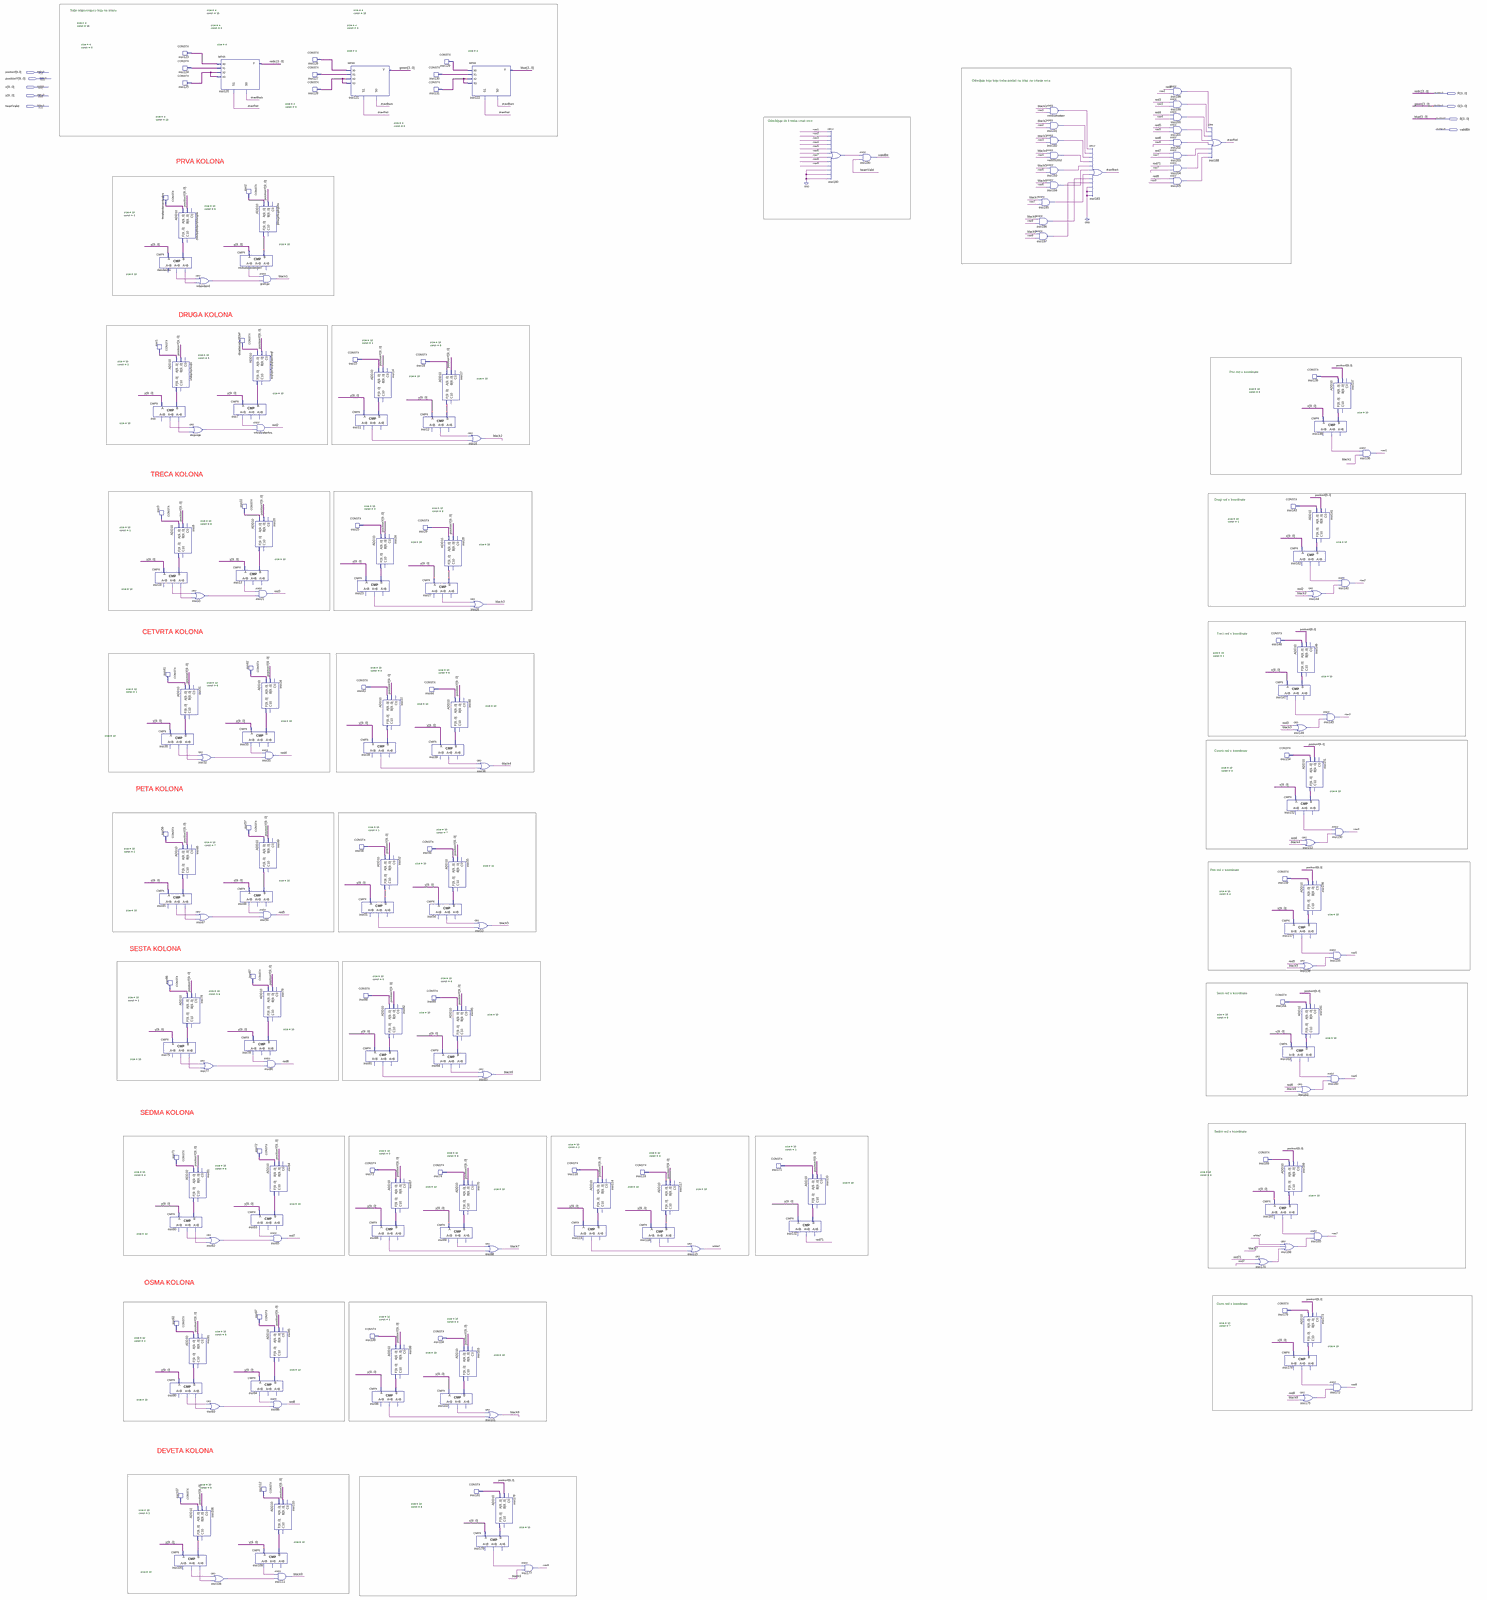
[diagram p0: schematic sheet, whole]
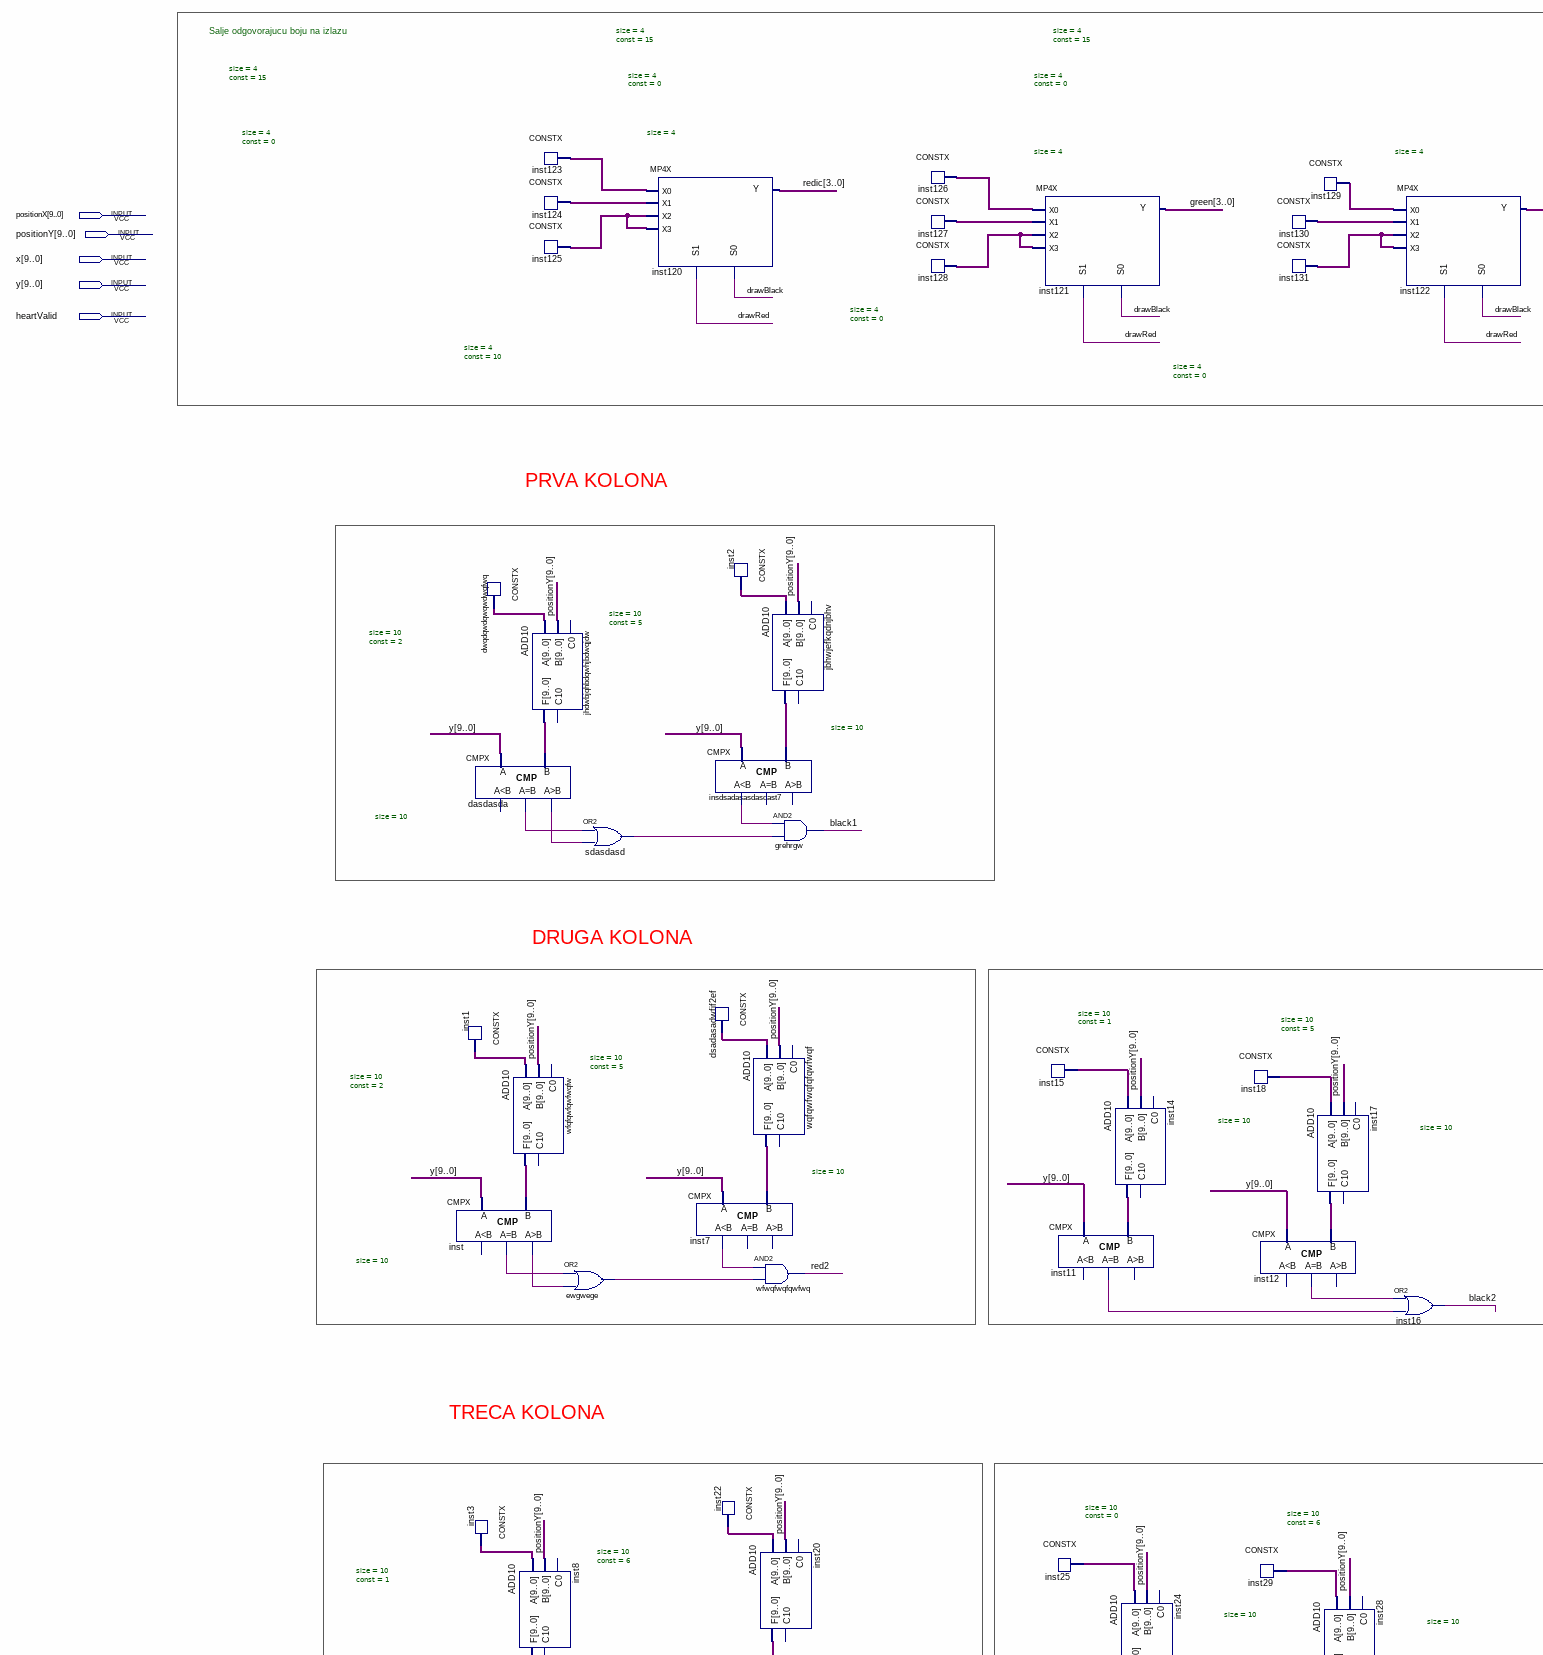
[diagram p1: schematic sheet, upper left part]
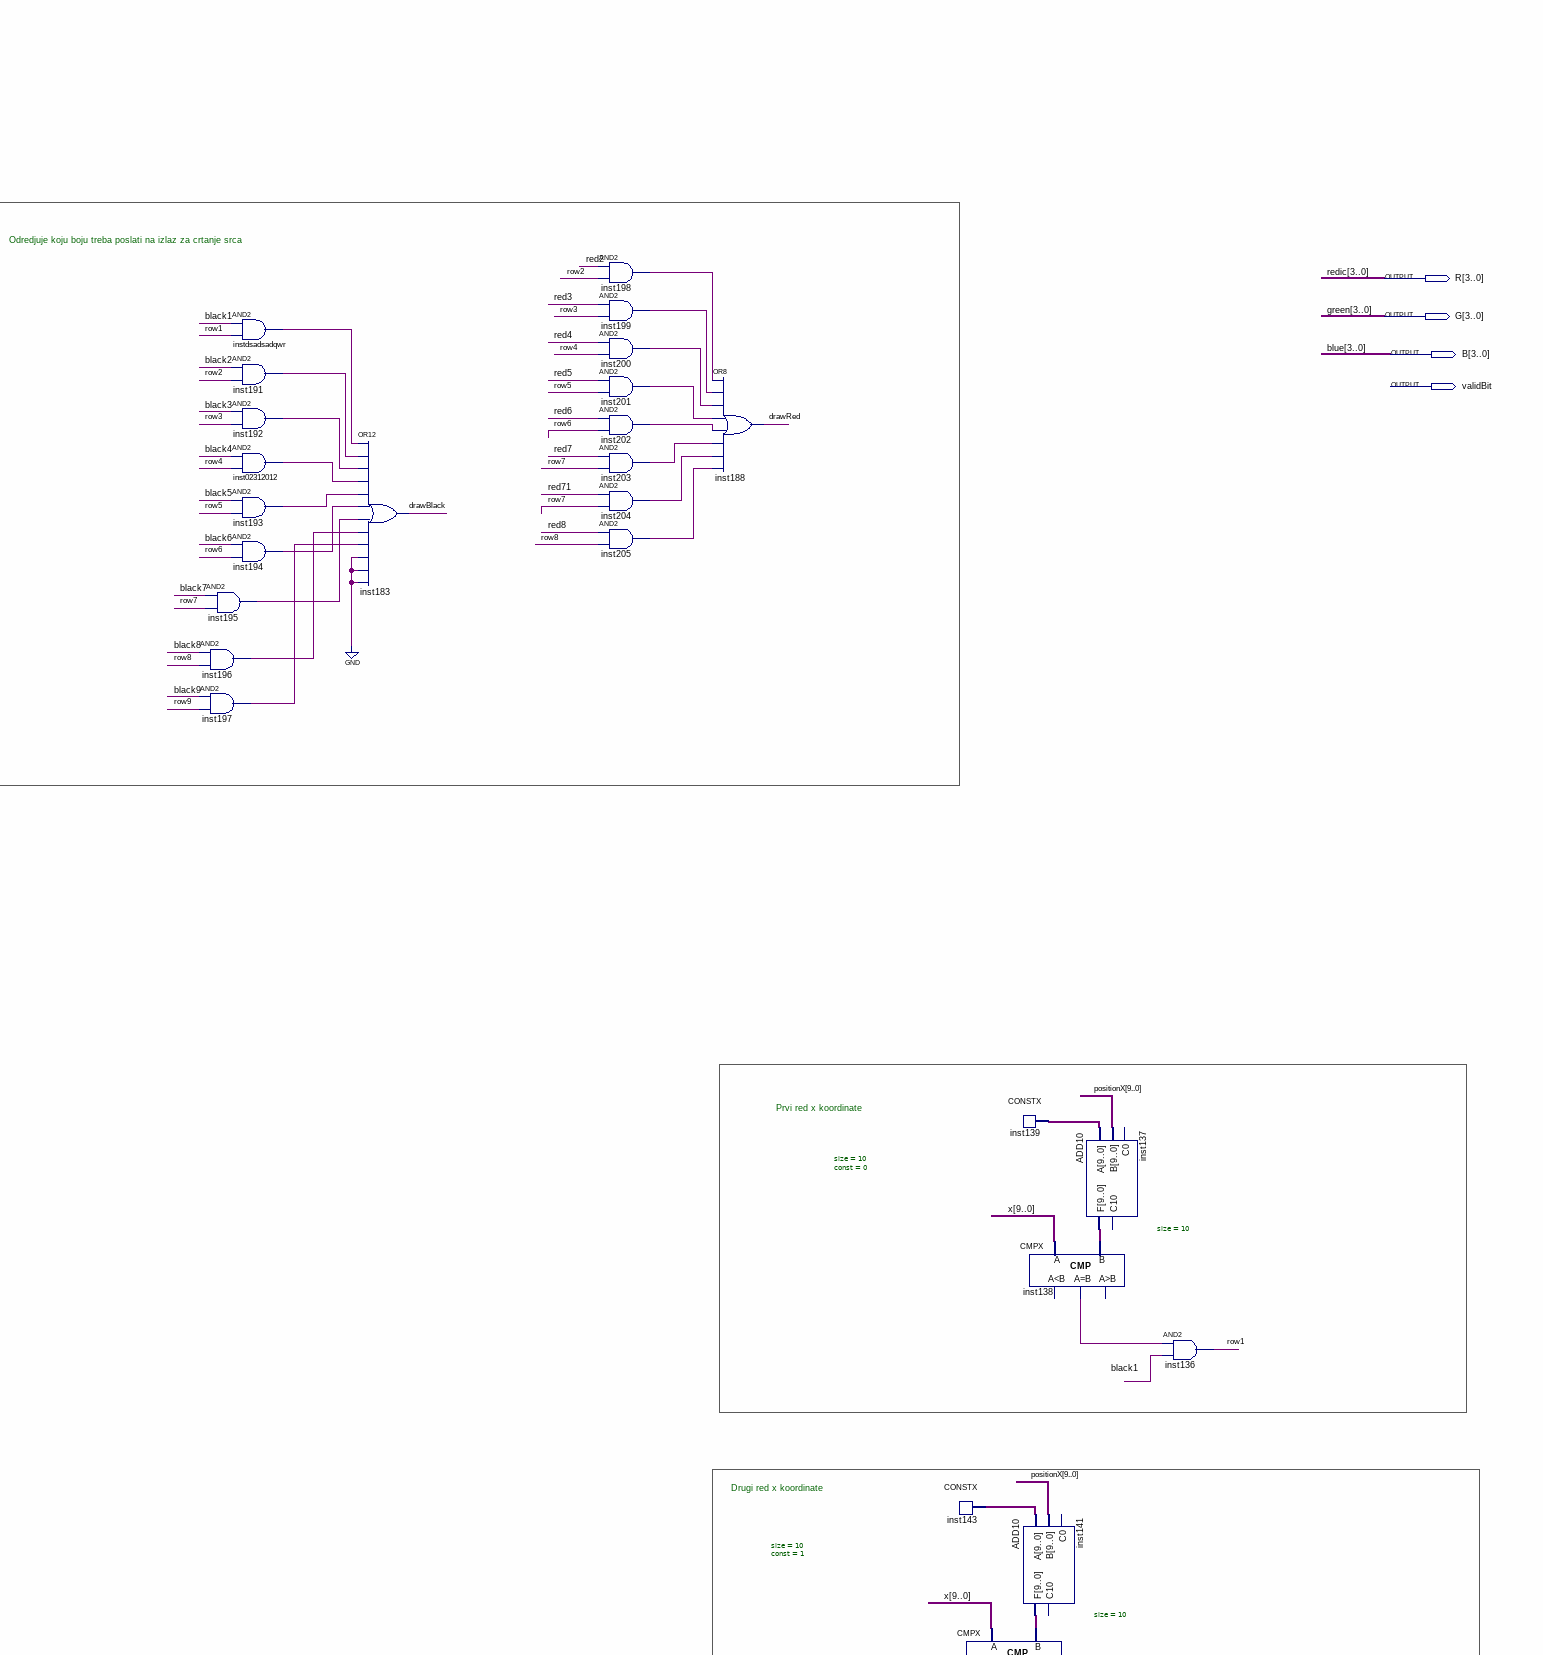
[diagram p2: schematic sheet, upper right part]
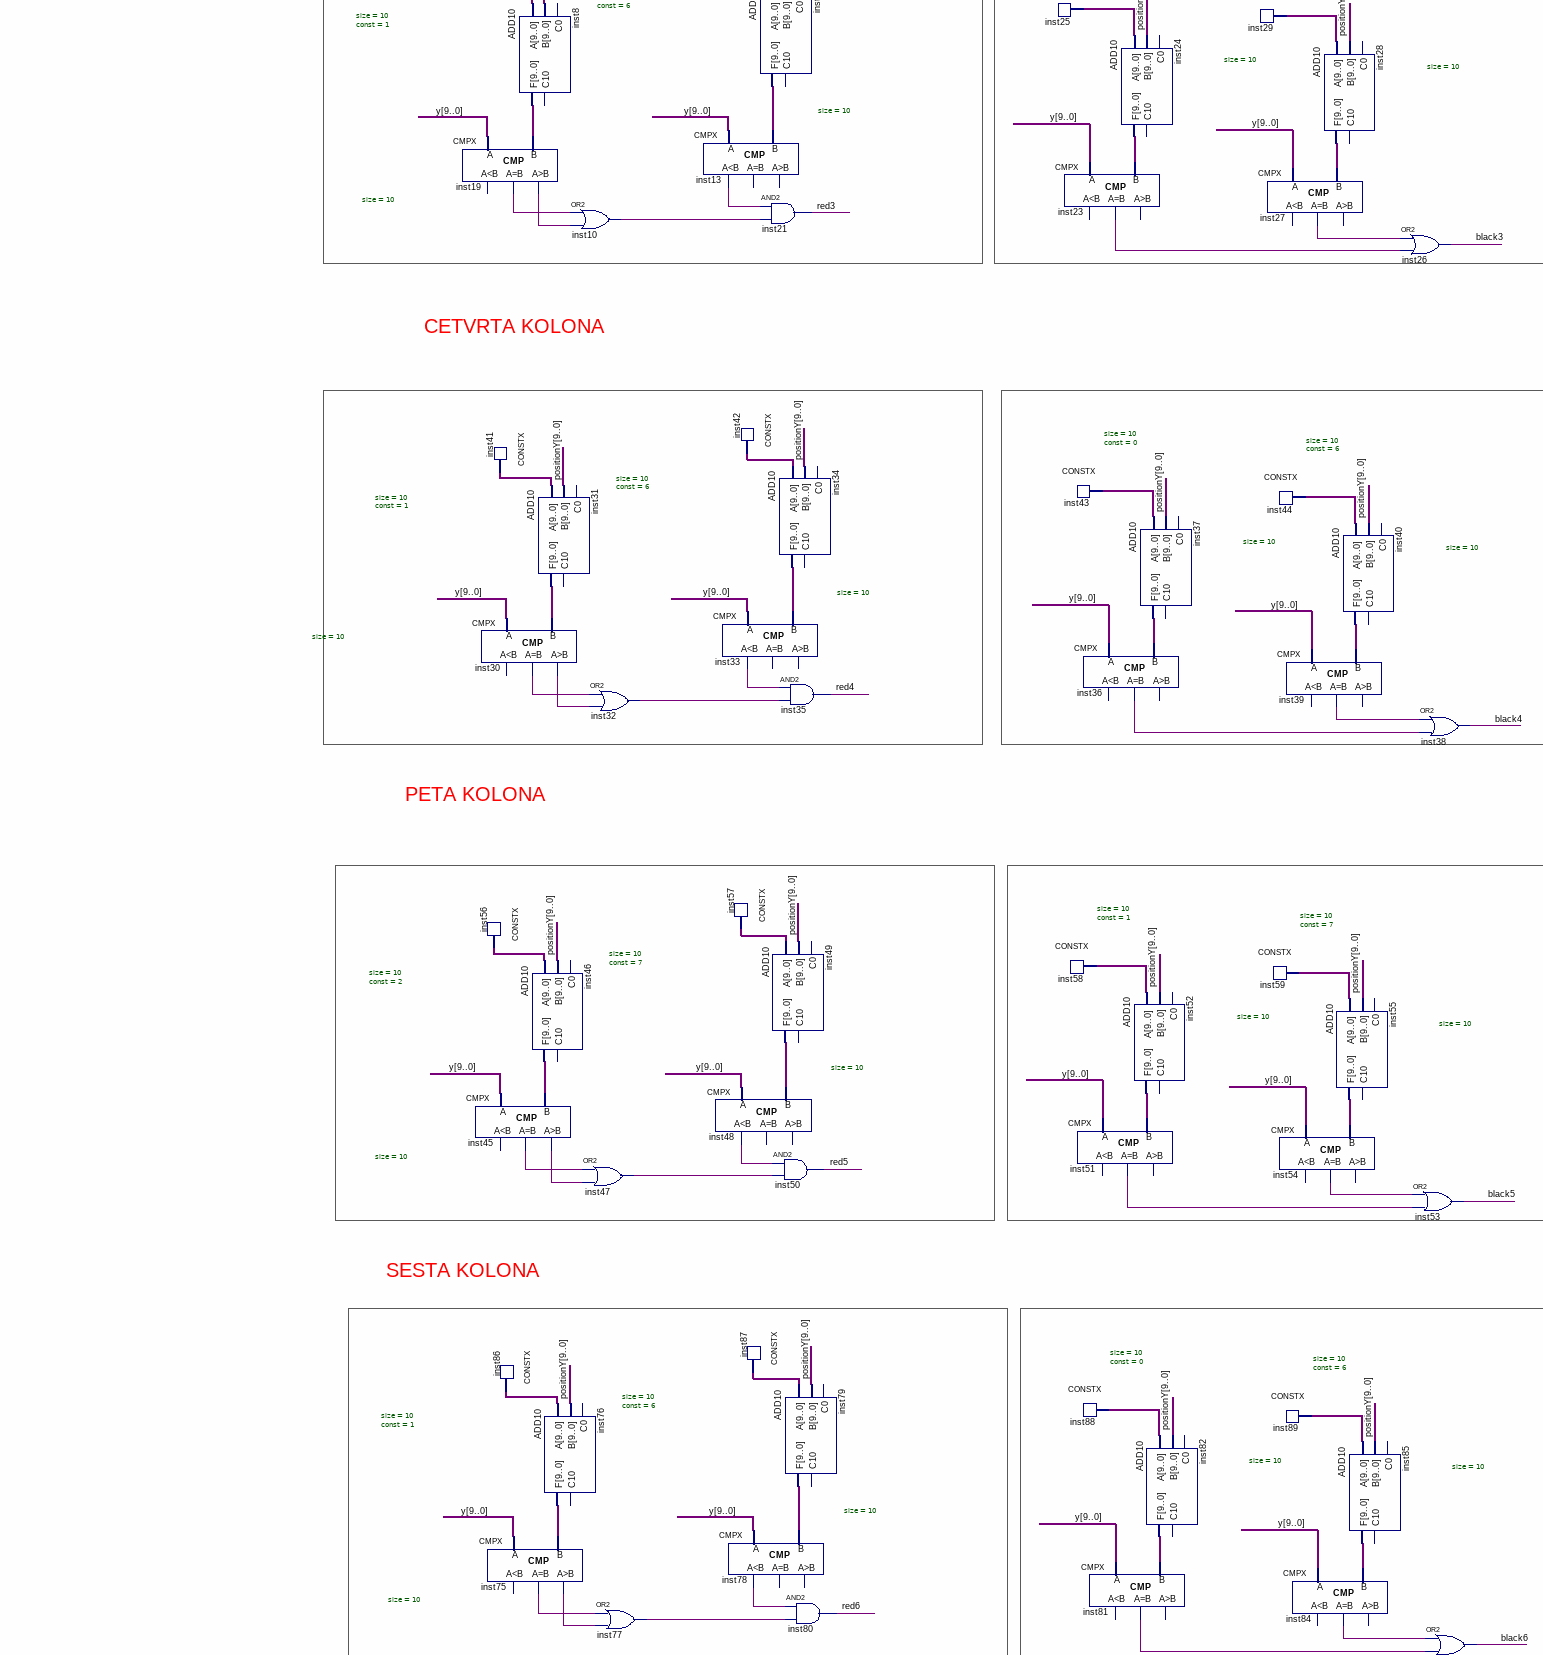
[diagram p3: schematic sheet, middle left part]
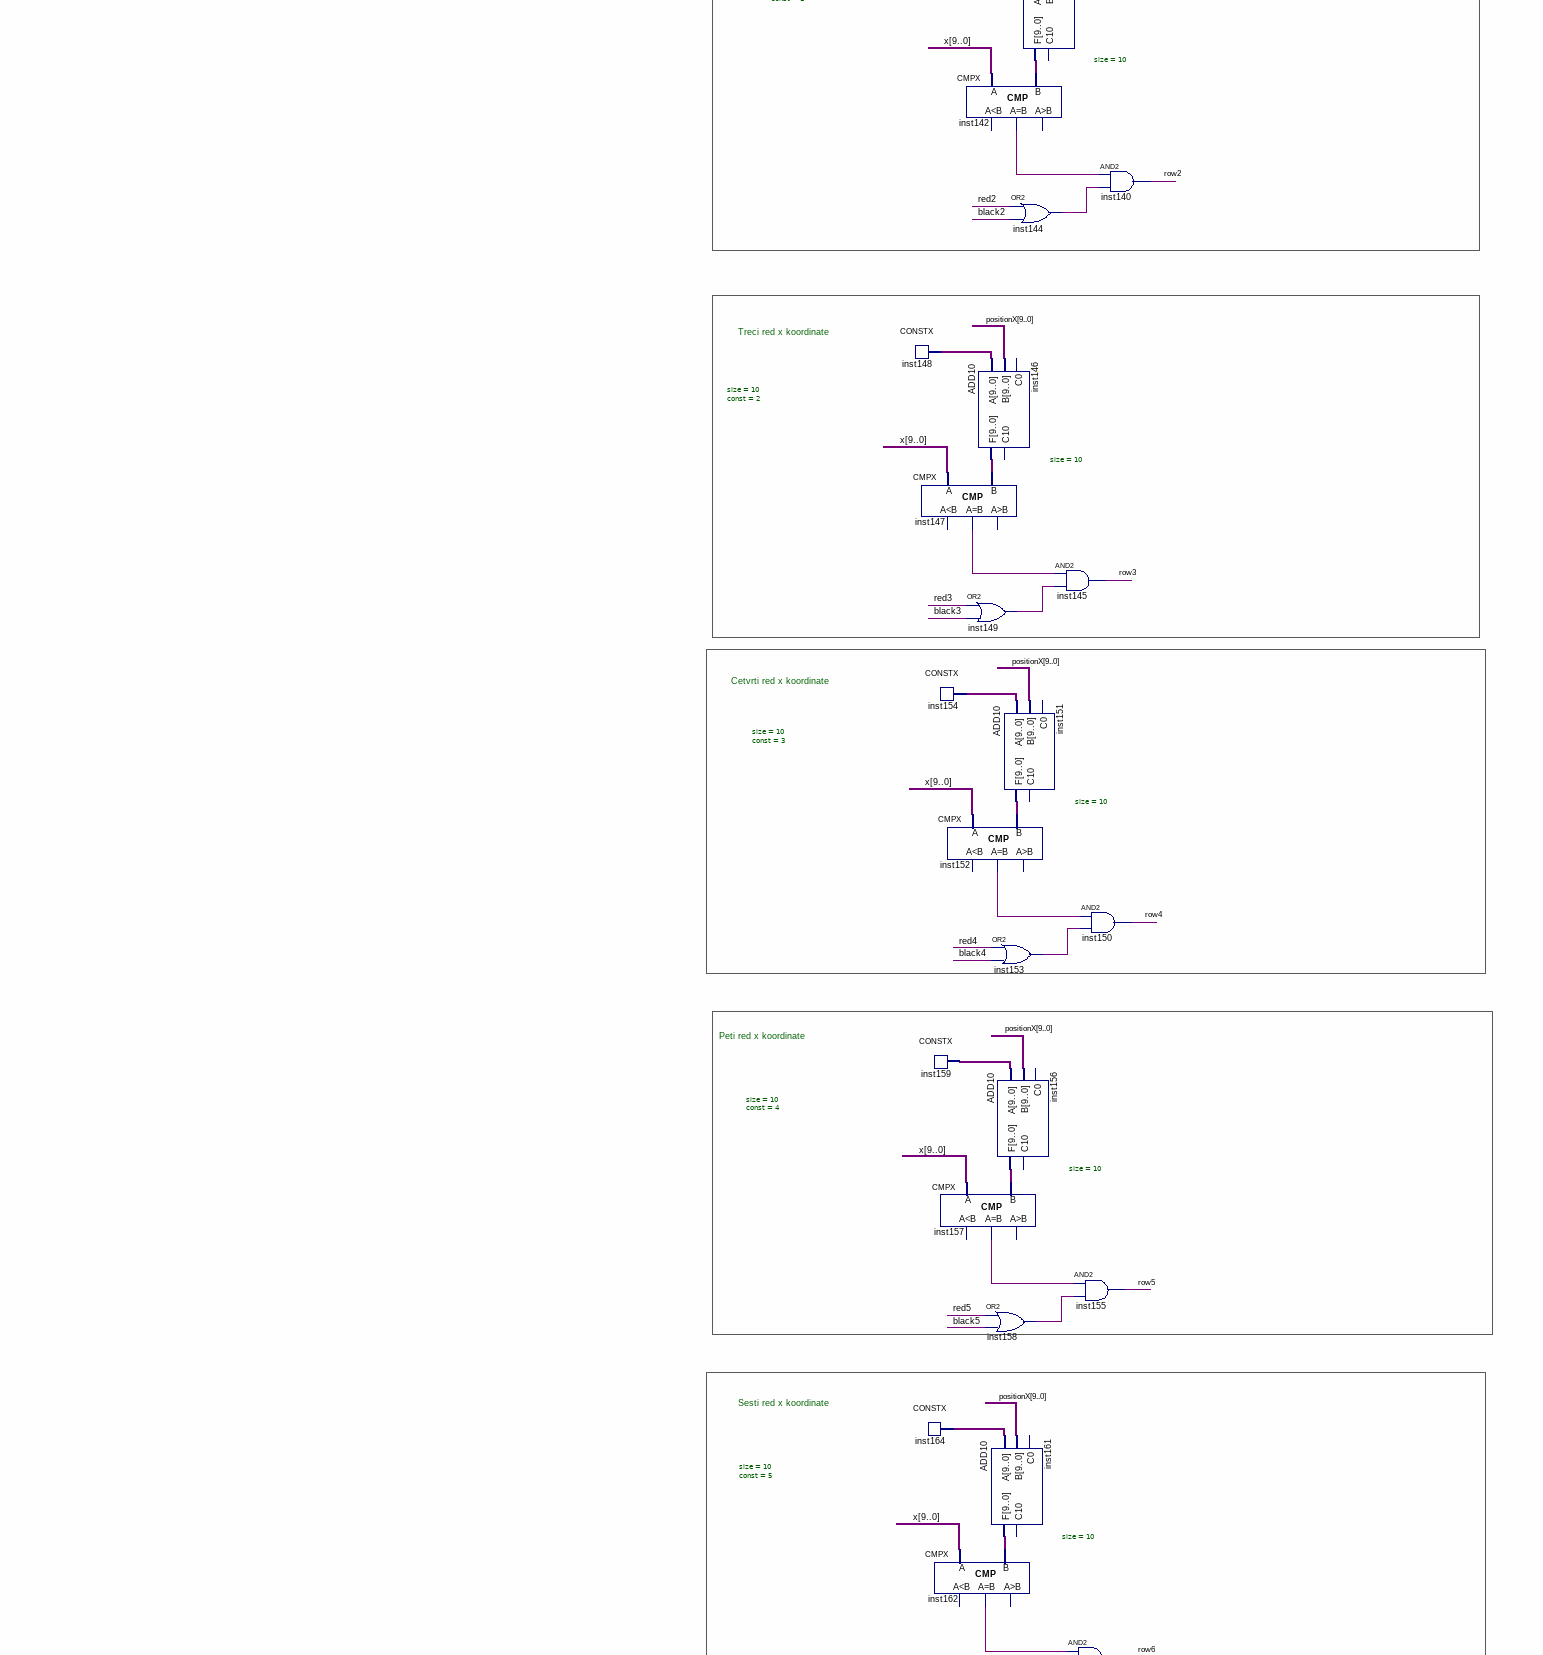
[diagram p4: schematic sheet, middle right part]
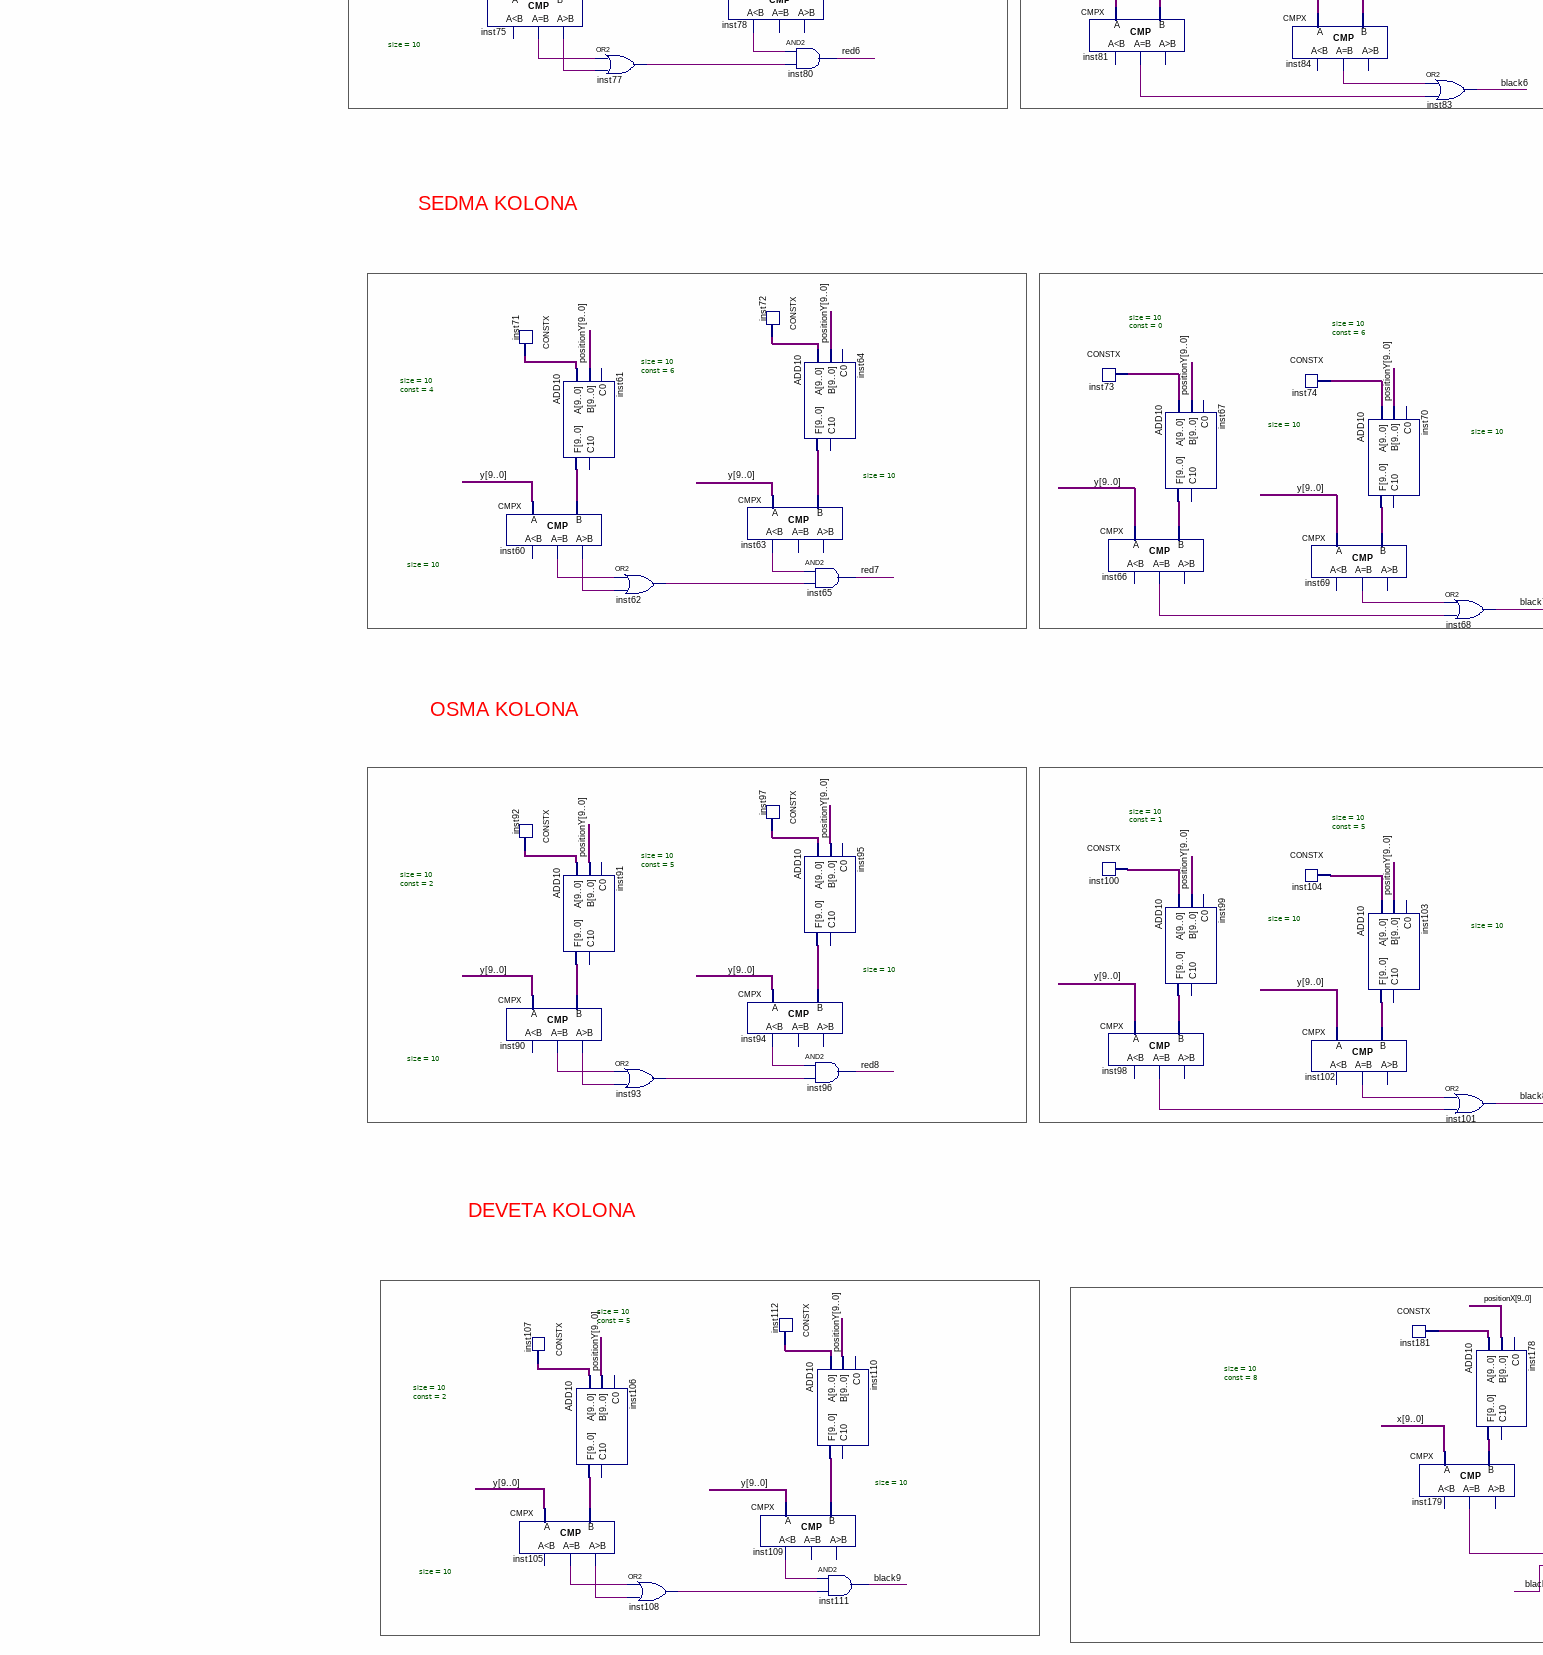
[diagram p5: schematic sheet, lower left part]
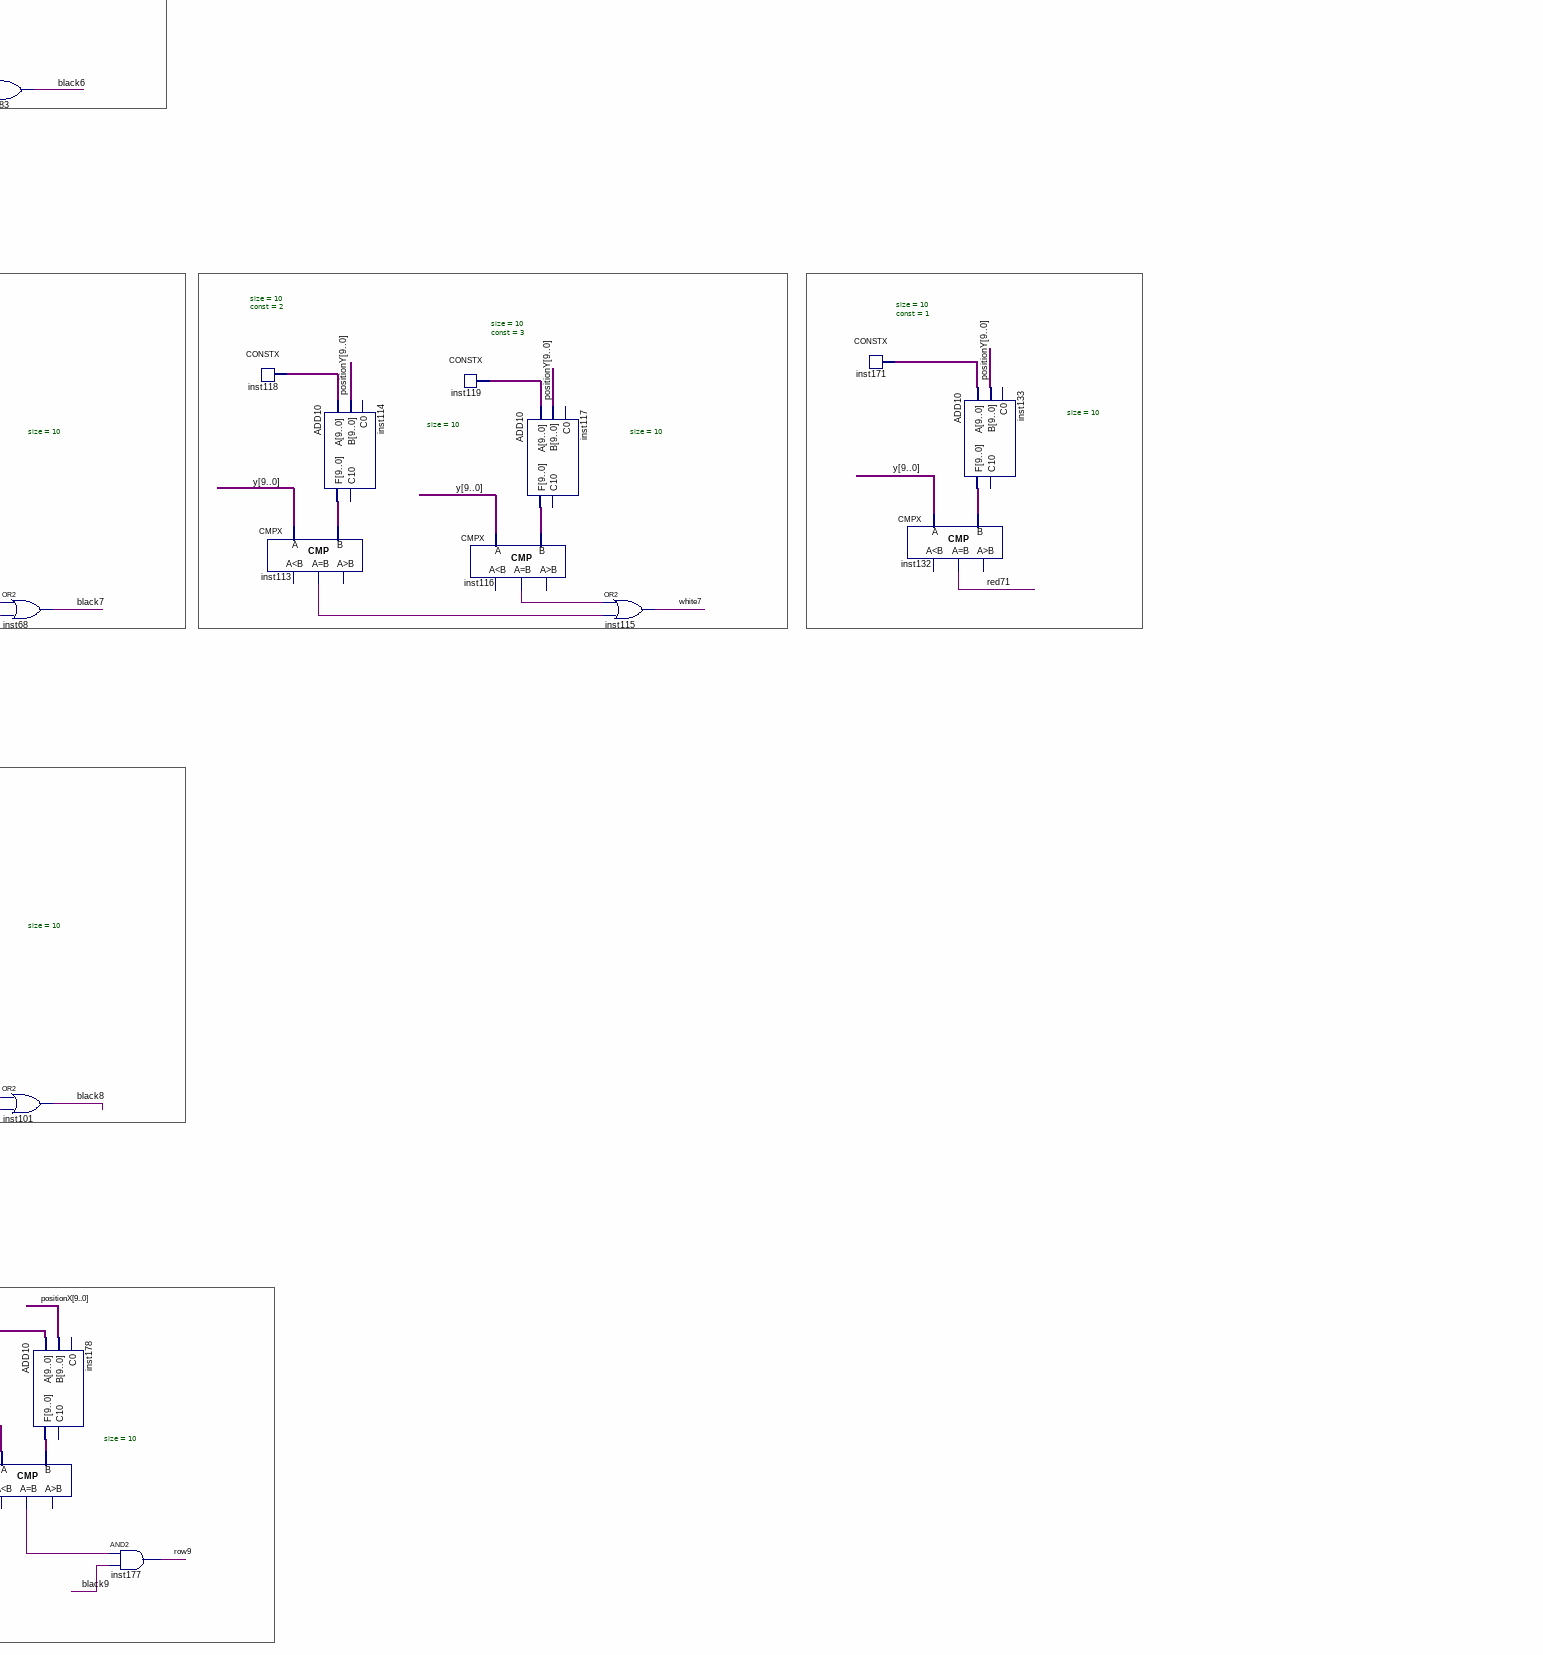
[diagram p6: schematic sheet, lower centre part]
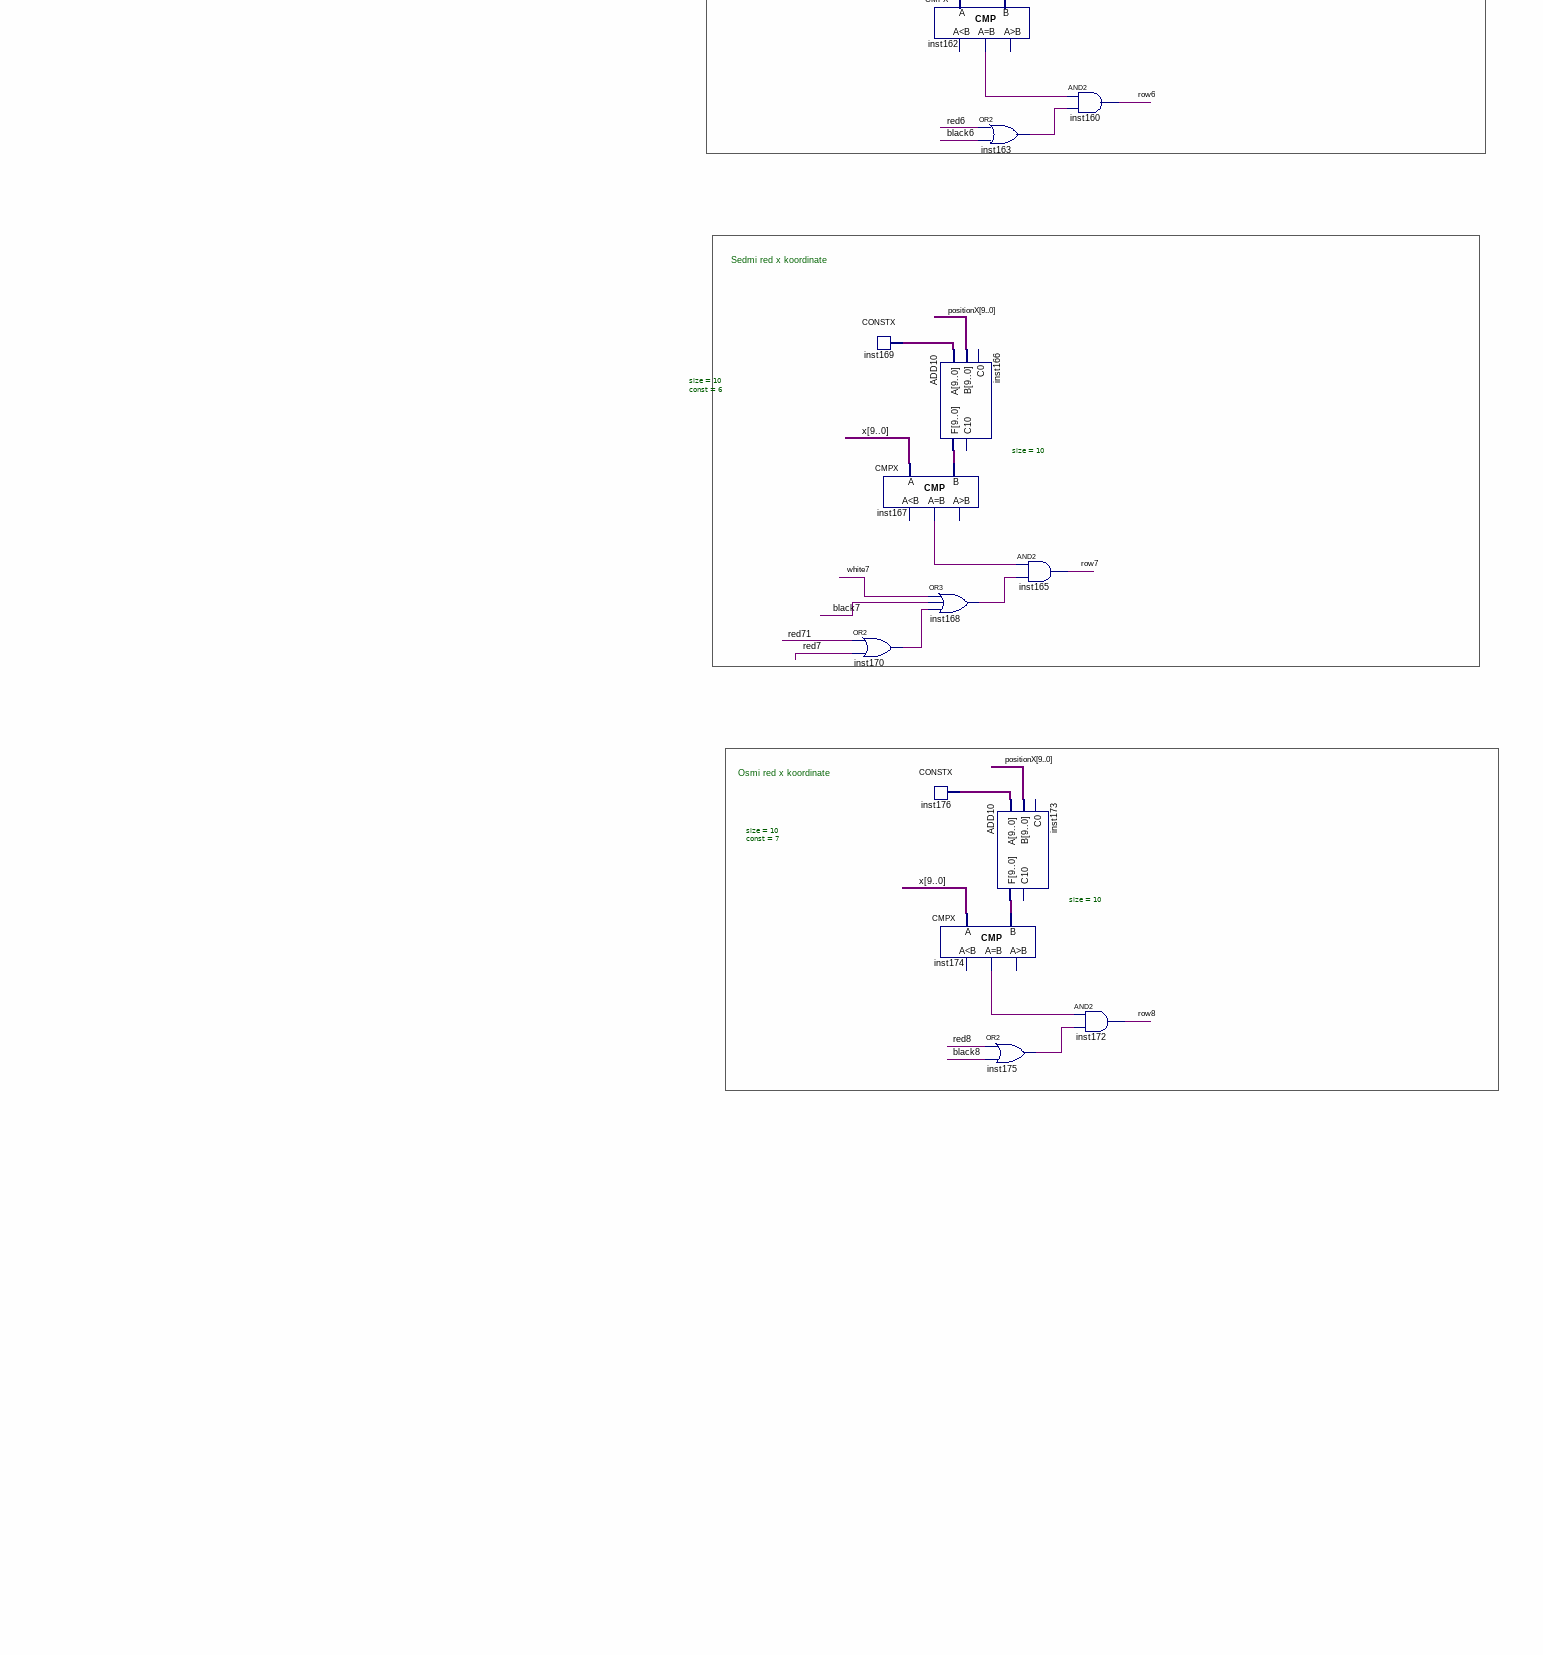
[diagram p7: schematic sheet, lower right part]
// Quartus schematic HeartShape.bdf as structural Verilog: 208 symbols, 9 pins
module HeartShape (
  input  [9:0] positionX,
  input  [9:0] positionY,
  input  [9:0] x,
  input  [9:0] y,
  input  heartValid,
  output [3:0] R,
  output [3:0] G,
  output [3:0] B,
  output validBit
);

  wire black1, black2, black3, black4, black5, black6, black7, black8, black9, dasdasda_eq, dasdasda_gr,
       drawBlack, drawRed, ewgwege_out, insdsadasasdasdast7_ls, inst7_ls, inst10_out, inst11_eq, inst12_eq,
       inst13_ls, inst19_eq, inst19_gr, inst23_eq, inst27_eq, inst30_eq, inst30_gr, inst32_out, inst33_ls,
       inst36_eq, inst39_eq, inst45_eq, inst45_gr, inst47_out, inst48_ls, inst51_eq, inst54_eq, inst60_eq,
       inst60_gr, inst62_out, inst63_ls, inst66_eq, inst69_eq, inst75_eq, inst75_gr, inst77_out, inst78_ls,
       inst81_eq, inst84_eq, inst90_eq, inst90_gr, inst93_out, inst94_ls, inst98_eq, inst102_eq, inst105_eq,
       inst105_gr, inst108_out, inst109_ls, inst113_eq, inst116_eq, inst138_eq, inst142_eq, inst144_out,
       inst147_eq, inst149_out, inst152_eq, inst153_out, inst157_eq, inst158_out, inst162_eq, inst163_out,
       inst167_eq, inst168_out, inst170_out, inst174_eq, inst175_out, inst179_eq, inst180_out, inst191_out,
       inst192_out, inst193_out, inst194_out, inst195_out, inst196_out, inst197_out, inst198_out,
       inst199_out, inst200_out, inst201_out, inst202_out, inst203_out, inst204_out, inst205_out,
       inst02312012_out, inst_eq, inst_gr, instdsadsadqwr_out, red2, red3, red4, red5, red6, red7, red8,
       red71, row1, row2, row3, row4, row5, row6, row7, row8, row9, sdasdasd_out, white7;
  wire [3:0] inst123_data, inst124_data, inst125_data, inst126_data, inst127_data, inst128_data,
       inst129_data, inst130_data, inst131_data;
  wire [9:0] dsadasadwfif2ef_data, dwqdqwdqwqwdwqfwq_data, inst1_data, inst2_data, inst3_data, inst8_f,
       inst14_f, inst15_data, inst17_f, inst18_data, inst20_f, inst22_data, inst24_f, inst25_data, inst28_f,
       inst29_data, inst31_f, inst34_f, inst37_f, inst40_f, inst41_data, inst42_data, inst43_data,
       inst44_data, inst46_f, inst49_f, inst52_f, inst55_f, inst56_data, inst57_data, inst58_data,
       inst59_data, inst61_f, inst64_f, inst67_f, inst70_f, inst71_data, inst72_data, inst73_data,
       inst74_data, inst76_f, inst79_f, inst82_f, inst85_f, inst86_data, inst87_data, inst88_data,
       inst89_data, inst91_f, inst92_data, inst95_f, inst97_data, inst99_f, inst100_data, inst103_f,
       inst104_data, inst106_f, inst107_data, inst110_f, inst112_data, inst114_f, inst117_f, inst118_data,
       inst119_data, inst133_f, inst137_f, inst139_data, inst141_f, inst143_data, inst146_f, inst148_data,
       inst151_f, inst154_data, inst156_f, inst159_data, inst161_f, inst164_data, inst166_f, inst169_data,
       inst171_data, inst173_f, inst176_data, inst178_f, inst181_data, jbhwjefkqdnjbhv_f,
       jhdwbjqhbdqwhjbdwqjdw_f, wfqfqwfqwfwqfw_f, wqfqwfwqfqfqwfwqf_f;

  CMPX #(.size(10)) inst (.A(y), .B(wfqfqwfqwfwqfw_f), .eq(inst_eq), .gr(inst_gr));  // open: ls
  CONSTX #(.size(10), .\const (2)) dwqdqwdqwqwdwqfwq (.data(dwqdqwdqwqwdwqfwq_data));
  CMPX #(.size(10)) dasdasda (.A(y), .B(jhdwbjqhbdqwhjbdwqjdw_f), .eq(dasdasda_eq), .gr(dasdasda_gr));  // open: ls
  CONSTX #(.size(10), .\const (2)) inst1 (.data(inst1_data));
  CONSTX #(.size(10), .\const (1)) inst3 (.data(inst3_data));
  CMPX #(.size(10)) inst19 (.A(y), .B(inst8_f), .eq(inst19_eq), .gr(inst19_gr));  // open: ls
  CONSTX #(.size(10), .\const (1)) inst41 (.data(inst41_data));
  CMPX #(.size(10)) inst30 (.A(y), .B(inst31_f), .eq(inst30_eq), .gr(inst30_gr));  // open: ls
  CONSTX #(.size(10), .\const (2)) inst56 (.data(inst56_data));
  CMPX #(.size(10)) inst45 (.A(y), .B(inst46_f), .eq(inst45_eq), .gr(inst45_gr));  // open: ls
  CONSTX #(.size(10), .\const (1)) inst86 (.data(inst86_data));
  CMPX #(.size(10)) inst75 (.A(y), .B(inst76_f), .eq(inst75_eq), .gr(inst75_gr));  // open: ls
  CMPX #(.size(10)) inst60 (.A(y), .B(inst61_f), .eq(inst60_eq), .gr(inst60_gr));  // open: ls
  CMPX #(.size(10)) inst90 (.A(y), .B(inst91_f), .eq(inst90_eq), .gr(inst90_gr));  // open: ls
  CONSTX #(.size(4), .\const (15)) inst123 (.data(inst123_data));
  CONSTX #(.size(4), .\const (0)) inst124 (.data(inst124_data));
  CONSTX #(.size(4), .\const (10)) inst125 (.data(inst125_data));
  ADD10 jhdwbjqhbdqwhjbdwqjdw (
    .A(dwqdqwdqwqwdwqfwq_data), .B(positionY), .F(jhdwbjqhbdqwhjbdwqjdw_f));  // open: C0, C10
  ADD10 wfqfqwfqwfwqfw (.A(inst1_data), .B(positionY), .F(wfqfqwfqwfwqfw_f));  // open: C0, C10
  ADD10 inst8 (.A(inst3_data), .B(positionY), .F(inst8_f));  // open: C0, C10
  ADD10 inst31 (.A(inst41_data), .B(positionY), .F(inst31_f));  // open: C0, C10
  ADD10 inst46 (.A(inst56_data), .B(positionY), .F(inst46_f));  // open: C0, C10
  ADD10 inst76 (.A(inst86_data), .B(positionY), .F(inst76_f));  // open: C0, C10
  CONSTX #(.size(10), .\const (4)) inst71 (.data(inst71_data));
  CONSTX #(.size(10), .\const (2)) inst92 (.data(inst92_data));
  CONSTX #(.size(10), .\const (2)) inst107 (.data(inst107_data));
  CMPX #(.size(10)) inst105 (.A(y), .B(inst106_f), .eq(inst105_eq), .gr(inst105_gr));  // open: ls
  or sdasdasd (sdasdasd_out, dasdasda_eq, dasdasda_gr);
  or ewgwege (ewgwege_out, inst_eq, inst_gr);
  or inst10 (inst10_out, inst19_eq, inst19_gr);
  or inst32 (inst32_out, inst30_eq, inst30_gr);
  or inst47 (inst47_out, inst45_eq, inst45_gr);
  or inst77 (inst77_out, inst75_eq, inst75_gr);
  ADD10 inst61 (.A(inst71_data), .B(positionY), .F(inst61_f));  // open: C0, C10
  ADD10 inst91 (.A(inst92_data), .B(positionY), .F(inst91_f));  // open: C0, C10
  ADD10 inst106 (.A(inst107_data), .B(positionY), .F(inst106_f));  // open: C0, C10
  MP4X #(.size(4)) inst120 (
    .X0(inst123_data), .X1(inst124_data), .X2(inst125_data), .X3(inst125_data), .S1(drawRed), .S0(drawBlack),
    .Y(R));
  or inst62 (inst62_out, inst60_eq, inst60_gr);
  or inst93 (inst93_out, inst90_eq, inst90_gr);
  or inst108 (inst108_out, inst105_eq, inst105_gr);
  CMPX #(.size(10)) inst7 (.A(y), .B(wqfqwfwqfqfqwfwqf_f), .ls(inst7_ls));  // open: eq, gr
  CMPX #(.size(10)) inst13 (.A(y), .B(inst20_f), .ls(inst13_ls));  // open: eq, gr
  CONSTX #(.size(10), .\const (5)) inst2 (.data(inst2_data));
  CMPX #(.size(10)) insdsadasasdasdast7 (.A(y), .B(jbhwjefkqdnjbhv_f), .ls(insdsadasasdasdast7_ls));  // open: eq, gr
  CONSTX #(.size(10), .\const (5)) dsadasadwfif2ef (.data(dsadasadwfif2ef_data));
  ADD10 wqfqwfwqfqfqwfwqf (.A(dsadasadwfif2ef_data), .B(positionY), .F(wqfqwfwqfqfqwfwqf_f));  // open: C0, C10
  CONSTX #(.size(10), .\const (6)) inst22 (.data(inst22_data));
  ADD10 inst20 (.A(inst22_data), .B(positionY), .F(inst20_f));  // open: C0, C10
  CONSTX #(.size(10), .\const (6)) inst42 (.data(inst42_data));
  CMPX #(.size(10)) inst33 (.A(y), .B(inst34_f), .ls(inst33_ls));  // open: eq, gr
  CONSTX #(.size(10), .\const (7)) inst57 (.data(inst57_data));
  CMPX #(.size(10)) inst48 (.A(y), .B(inst49_f), .ls(inst48_ls));  // open: eq, gr
  CONSTX #(.size(10), .\const (6)) inst87 (.data(inst87_data));
  CMPX #(.size(10)) inst78 (.A(y), .B(inst79_f), .ls(inst78_ls));  // open: eq, gr
  CMPX #(.size(10)) inst63 (.A(y), .B(inst64_f), .ls(inst63_ls));  // open: eq, gr
  CMPX #(.size(10)) inst94 (.A(y), .B(inst95_f), .ls(inst94_ls));  // open: eq, gr
  CMPX #(.size(10)) inst109 (.A(y), .B(inst110_f), .ls(inst109_ls));  // open: eq, gr
  ADD10 jbhwjefkqdnjbhv (.A(inst2_data), .B(positionY), .F(jbhwjefkqdnjbhv_f));  // open: C0, C10
  and grehrgw (black1, insdsadasasdasdast7_ls, sdasdasd_out);
  and wfwqfwqfqwfwq (red2, inst7_ls, ewgwege_out);
  and inst21 (red3, inst13_ls, inst10_out);
  ADD10 inst34 (.A(inst42_data), .B(positionY), .F(inst34_f));  // open: C0, C10
  and inst35 (red4, inst33_ls, inst32_out);
  ADD10 inst49 (.A(inst57_data), .B(positionY), .F(inst49_f));  // open: C0, C10
  and inst50 (red5, inst48_ls, inst47_out);
  ADD10 inst79 (.A(inst87_data), .B(positionY), .F(inst79_f));  // open: C0, C10
  and inst80 (red6, inst78_ls, inst77_out);
  CONSTX #(.size(10), .\const (6)) inst72 (.data(inst72_data));
  ADD10 inst64 (.A(inst72_data), .B(positionY), .F(inst64_f));  // open: C0, C10
  CONSTX #(.size(10), .\const (5)) inst97 (.data(inst97_data));
  ADD10 inst95 (.A(inst97_data), .B(positionY), .F(inst95_f));  // open: C0, C10
  CONSTX #(.size(10), .\const (5)) inst112 (.data(inst112_data));
  and inst65 (red7, inst63_ls, inst62_out);
  and inst96 (red8, inst94_ls, inst93_out);
  ADD10 inst110 (.A(inst112_data), .B(positionY), .F(inst110_f));  // open: C0, C10
  and inst111 (black9, inst109_ls, inst108_out);
  CONSTX #(.size(4), .\const (15)) inst126 (.data(inst126_data));
  CONSTX #(.size(4), .\const (0)) inst127 (.data(inst127_data));
  CONSTX #(.size(4), .\const (0)) inst128 (.data(inst128_data));
  MP4X #(.size(4)) inst121 (
    .X0(inst126_data), .X1(inst127_data), .X2(inst128_data), .X3(inst128_data), .S1(drawRed), .S0(drawBlack),
    .Y(G));
  CONSTX #(.size(10), .\const (1)) inst15 (.data(inst15_data));
  CMPX #(.size(10)) inst11 (.A(y), .B(inst14_f), .eq(inst11_eq));  // open: ls, gr
  CONSTX #(.size(10), .\const (0)) inst25 (.data(inst25_data));
  CMPX #(.size(10)) inst23 (.A(y), .B(inst24_f), .eq(inst23_eq));  // open: ls, gr
  CONSTX #(.size(10), .\const (1)) inst58 (.data(inst58_data));
  ADD10 inst14 (.A(inst15_data), .B(positionY), .F(inst14_f));  // open: C0, C10
  CONSTX #(.size(10), .\const (0)) inst43 (.data(inst43_data));
  CMPX #(.size(10)) inst36 (.A(y), .B(inst37_f), .eq(inst36_eq));  // open: ls, gr
  CMPX #(.size(10)) inst51 (.A(y), .B(inst52_f), .eq(inst51_eq));  // open: ls, gr
  CONSTX #(.size(10), .\const (0)) inst88 (.data(inst88_data));
  CMPX #(.size(10)) inst81 (.A(y), .B(inst82_f), .eq(inst81_eq));  // open: ls, gr
  CONSTX #(.size(10), .\const (0)) inst73 (.data(inst73_data));
  CMPX #(.size(10)) inst66 (.A(y), .B(inst67_f), .eq(inst66_eq));  // open: ls, gr
  CONSTX #(.size(10), .\const (1)) inst100 (.data(inst100_data));
  CMPX #(.size(10)) inst98 (.A(y), .B(inst99_f), .eq(inst98_eq));  // open: ls, gr
  ADD10 inst24 (.A(inst25_data), .B(positionY), .F(inst24_f));  // open: C0, C10
  ADD10 inst37 (.A(inst43_data), .B(positionY), .F(inst37_f));  // open: C0, C10
  ADD10 inst52 (.A(inst58_data), .B(positionY), .F(inst52_f));  // open: C0, C10
  ADD10 inst82 (.A(inst88_data), .B(positionY), .F(inst82_f));  // open: C0, C10
  ADD10 inst67 (.A(inst73_data), .B(positionY), .F(inst67_f));  // open: C0, C10
  ADD10 inst99 (.A(inst100_data), .B(positionY), .F(inst99_f));  // open: C0, C10
  CONSTX #(.size(10), .\const (5)) inst18 (.data(inst18_data));
  CMPX #(.size(10)) inst12 (.A(y), .B(inst17_f), .eq(inst12_eq));  // open: ls, gr
  CONSTX #(.size(10), .\const (6)) inst29 (.data(inst29_data));
  CMPX #(.size(10)) inst27 (.A(y), .B(inst28_f), .eq(inst27_eq));  // open: ls, gr
  CONSTX #(.size(10), .\const (7)) inst59 (.data(inst59_data));
  CONSTX #(.size(4), .\const (15)) inst129 (.data(inst129_data));
  CONSTX #(.size(4), .\const (0)) inst130 (.data(inst130_data));
  CONSTX #(.size(4), .\const (0)) inst131 (.data(inst131_data));
  ADD10 inst17 (.A(inst18_data), .B(positionY), .F(inst17_f));  // open: C0, C10
  CONSTX #(.size(10), .\const (6)) inst44 (.data(inst44_data));
  CMPX #(.size(10)) inst39 (.A(y), .B(inst40_f), .eq(inst39_eq));  // open: ls, gr
  CMPX #(.size(10)) inst54 (.A(y), .B(inst55_f), .eq(inst54_eq));  // open: ls, gr
  CONSTX #(.size(10), .\const (6)) inst89 (.data(inst89_data));
  CMPX #(.size(10)) inst84 (.A(y), .B(inst85_f), .eq(inst84_eq));  // open: ls, gr
  CONSTX #(.size(10), .\const (6)) inst74 (.data(inst74_data));
  CMPX #(.size(10)) inst69 (.A(y), .B(inst70_f), .eq(inst69_eq));  // open: ls, gr
  CONSTX #(.size(10), .\const (5)) inst104 (.data(inst104_data));
  CMPX #(.size(10)) inst102 (.A(y), .B(inst103_f), .eq(inst102_eq));  // open: ls, gr
  ADD10 inst28 (.A(inst29_data), .B(positionY), .F(inst28_f));  // open: C0, C10
  ADD10 inst40 (.A(inst44_data), .B(positionY), .F(inst40_f));  // open: C0, C10
  ADD10 inst55 (.A(inst59_data), .B(positionY), .F(inst55_f));  // open: C0, C10
  ADD10 inst85 (.A(inst89_data), .B(positionY), .F(inst85_f));  // open: C0, C10
  ADD10 inst70 (.A(inst74_data), .B(positionY), .F(inst70_f));  // open: C0, C10
  ADD10 inst103 (.A(inst104_data), .B(positionY), .F(inst103_f));  // open: C0, C10
  MP4X #(.size(4)) inst122 (
    .X0(inst129_data), .X1(inst130_data), .X2(inst131_data), .X3(inst131_data), .S1(drawRed), .S0(drawBlack),
    .Y(B));
  or inst16 (black2, inst12_eq, inst11_eq);
  or inst26 (black3, inst27_eq, inst23_eq);
  CONSTX #(.size(10), .\const (8)) inst181 (.data(inst181_data));
  CMPX #(.size(10)) inst179 (.A(x), .B(inst178_f), .eq(inst179_eq));  // open: ls, gr
  or inst38 (black4, inst39_eq, inst36_eq);
  or inst53 (black5, inst54_eq, inst51_eq);
  or inst83 (black6, inst84_eq, inst81_eq);
  or inst68 (black7, inst69_eq, inst66_eq);
  or inst101 (black8, inst102_eq, inst98_eq);
  ADD10 inst178 (.A(inst181_data), .B(positionX), .F(inst178_f));  // open: C0, C10
  and inst177 (row9, inst179_eq, black9);
  CONSTX #(.size(10), .\const (2)) inst118 (.data(inst118_data));
  CMPX #(.size(10)) inst113 (.A(y), .B(inst114_f), .eq(inst113_eq));  // open: ls, gr
  ADD10 inst114 (.A(inst118_data), .B(positionY), .F(inst114_f));  // open: C0, C10
  CONSTX #(.size(10), .\const (3)) inst119 (.data(inst119_data));
  CMPX #(.size(10)) inst116 (.A(y), .B(inst117_f), .eq(inst116_eq));  // open: ls, gr
  ADD10 inst117 (.A(inst119_data), .B(positionY), .F(inst117_f));  // open: C0, C10
  or inst115 (white7, inst116_eq, inst113_eq);
  CONSTX #(.size(10), .\const (1)) inst171 (.data(inst171_data));
  CMPX #(.size(10)) inst132 (.A(y), .B(inst133_f), .eq(red71));  // open: ls, gr
  ADD10 inst133 (.A(inst171_data), .B(positionY), .F(inst133_f));  // open: C0, C10
  or inst180 (inst180_out, row1, row2, row3, row4, row5, row6, row7, row8, row9, 1'b0, 1'b0, 1'b0);
  and inst190 (validBit, inst180_out, heartValid);
  and instdsadsadqwr (instdsadsadqwr_out, black1, row1);
  and inst191 (inst191_out, black2, row2);
  and inst192 (inst192_out, black3, row3);
  and inst02312012 (inst02312012_out, black4, row4);
  and inst193 (inst193_out, black5, row5);
  and inst194 (inst194_out, black6, row6);
  and inst195 (inst195_out, black7, row7);
  and inst196 (inst196_out, black8, row8);
  and inst197 (inst197_out, black9, row9);
  or inst183 (drawBlack, instdsadsadqwr_out, inst191_out, inst192_out, inst02312012_out, inst193_out, inst194_out, inst195_out, inst196_out, inst197_out, 1'b0, 1'b0, 1'b0);
  and inst198 (inst198_out, red2, row2);
  and inst199 (inst199_out, red3, row3);
  and inst200 (inst200_out, red4, row4);
  and inst201 (inst201_out, red5, row5);
  and inst202 (inst202_out, red6, row6);
  and inst203 (inst203_out, red7, row7);
  and inst204 (inst204_out, red71, row7);
  and inst205 (inst205_out, red8, row8);
  or inst188 (drawRed, inst198_out, inst199_out, inst200_out, inst201_out, inst202_out, inst203_out, inst204_out, inst205_out);
  or inst170 (inst170_out, red71, red7);
  CONSTX #(.size(10), .\const (2)) inst148 (.data(inst148_data));
  CONSTX #(.size(10), .\const (6)) inst169 (.data(inst169_data));
  CMPX #(.size(10)) inst167 (.A(x), .B(inst166_f), .eq(inst167_eq));  // open: ls, gr
  CONSTX #(.size(10), .\const (1)) inst143 (.data(inst143_data));
  CMPX #(.size(10)) inst142 (.A(x), .B(inst141_f), .eq(inst142_eq));  // open: ls, gr
  CMPX #(.size(10)) inst147 (.A(x), .B(inst146_f), .eq(inst147_eq));  // open: ls, gr
  CONSTX #(.size(10), .\const (3)) inst154 (.data(inst154_data));
  CMPX #(.size(10)) inst152 (.A(x), .B(inst151_f), .eq(inst152_eq));  // open: ls, gr
  CONSTX #(.size(10), .\const (4)) inst159 (.data(inst159_data));
  CMPX #(.size(10)) inst157 (.A(x), .B(inst156_f), .eq(inst157_eq));  // open: ls, gr
  CONSTX #(.size(10), .\const (5)) inst164 (.data(inst164_data));
  CMPX #(.size(10)) inst162 (.A(x), .B(inst161_f), .eq(inst162_eq));  // open: ls, gr
  ADD10 inst166 (.A(inst169_data), .B(positionX), .F(inst166_f));  // open: C0, C10
  or inst168 (inst168_out, white7, black7, inst170_out);
  CONSTX #(.size(10), .\const (7)) inst176 (.data(inst176_data));
  CMPX #(.size(10)) inst174 (.A(x), .B(inst173_f), .eq(inst174_eq));  // open: ls, gr
  CONSTX #(.size(10), .\const (0)) inst139 (.data(inst139_data));
  ADD10 inst146 (.A(inst148_data), .B(positionX), .F(inst146_f));  // open: C0, C10
  or inst149 (inst149_out, red3, black3);
  ADD10 inst151 (.A(inst154_data), .B(positionX), .F(inst151_f));  // open: C0, C10
  or inst153 (inst153_out, red4, black4);
  ADD10 inst156 (.A(inst159_data), .B(positionX), .F(inst156_f));  // open: C0, C10
  or inst158 (inst158_out, red5, black5);
  ADD10 inst161 (.A(inst164_data), .B(positionX), .F(inst161_f));  // open: C0, C10
  or inst163 (inst163_out, red6, black6);
  ADD10 inst173 (.A(inst176_data), .B(positionX), .F(inst173_f));  // open: C0, C10
  or inst175 (inst175_out, red8, black8);
  CMPX #(.size(10)) inst138 (.A(x), .B(inst137_f), .eq(inst138_eq));  // open: ls, gr
  ADD10 inst141 (.A(inst143_data), .B(positionX), .F(inst141_f));  // open: C0, C10
  or inst144 (inst144_out, red2, black2);
  and inst145 (row3, inst147_eq, inst149_out);
  and inst165 (row7, inst167_eq, inst168_out);
  ADD10 inst137 (.A(inst139_data), .B(positionX), .F(inst137_f));  // open: C0, C10
  and inst140 (row2, inst142_eq, inst144_out);
  and inst150 (row4, inst152_eq, inst153_out);
  and inst155 (row5, inst157_eq, inst158_out);
  and inst160 (row6, inst162_eq, inst163_out);
  and inst172 (row8, inst174_eq, inst175_out);
  and inst136 (row1, inst138_eq, black1);

  // Other names for the same wires on the sheet: blue[3:0] = B; green[3:0] = G; redic[3:0] = R

  // Notes on the sheet:
  //   Salje odgovorajucu boju na izlazu                                                                                            
  //   Odredjuje koju boju treba poslati na izlaz za crtanje srca                                                                                                                                               
  //   Odre3djuje da li treba crtati srce
  //   PRVA KOLONA
  //   DRUGA KOLONA
  //   Prvi red x koordinate
  //   TRECA KOLONA
  //   Drugi red x koordinate
  //   CETVRTA KOLONA
  //   Treci red x koordinate
  //   Cetvrti red x koordinate
  //   PETA KOLONA
  //   Peti red x koordinate
  //   SESTA KOLONA
  //   Sesti red x koordinate
  //   SEDMA KOLONA
  //   Sedmi red x koordinate                                                         
  //   OSMA KOLONA
  //   Osmi red x koordinate
  //   DEVETA KOLONA
endmodule
